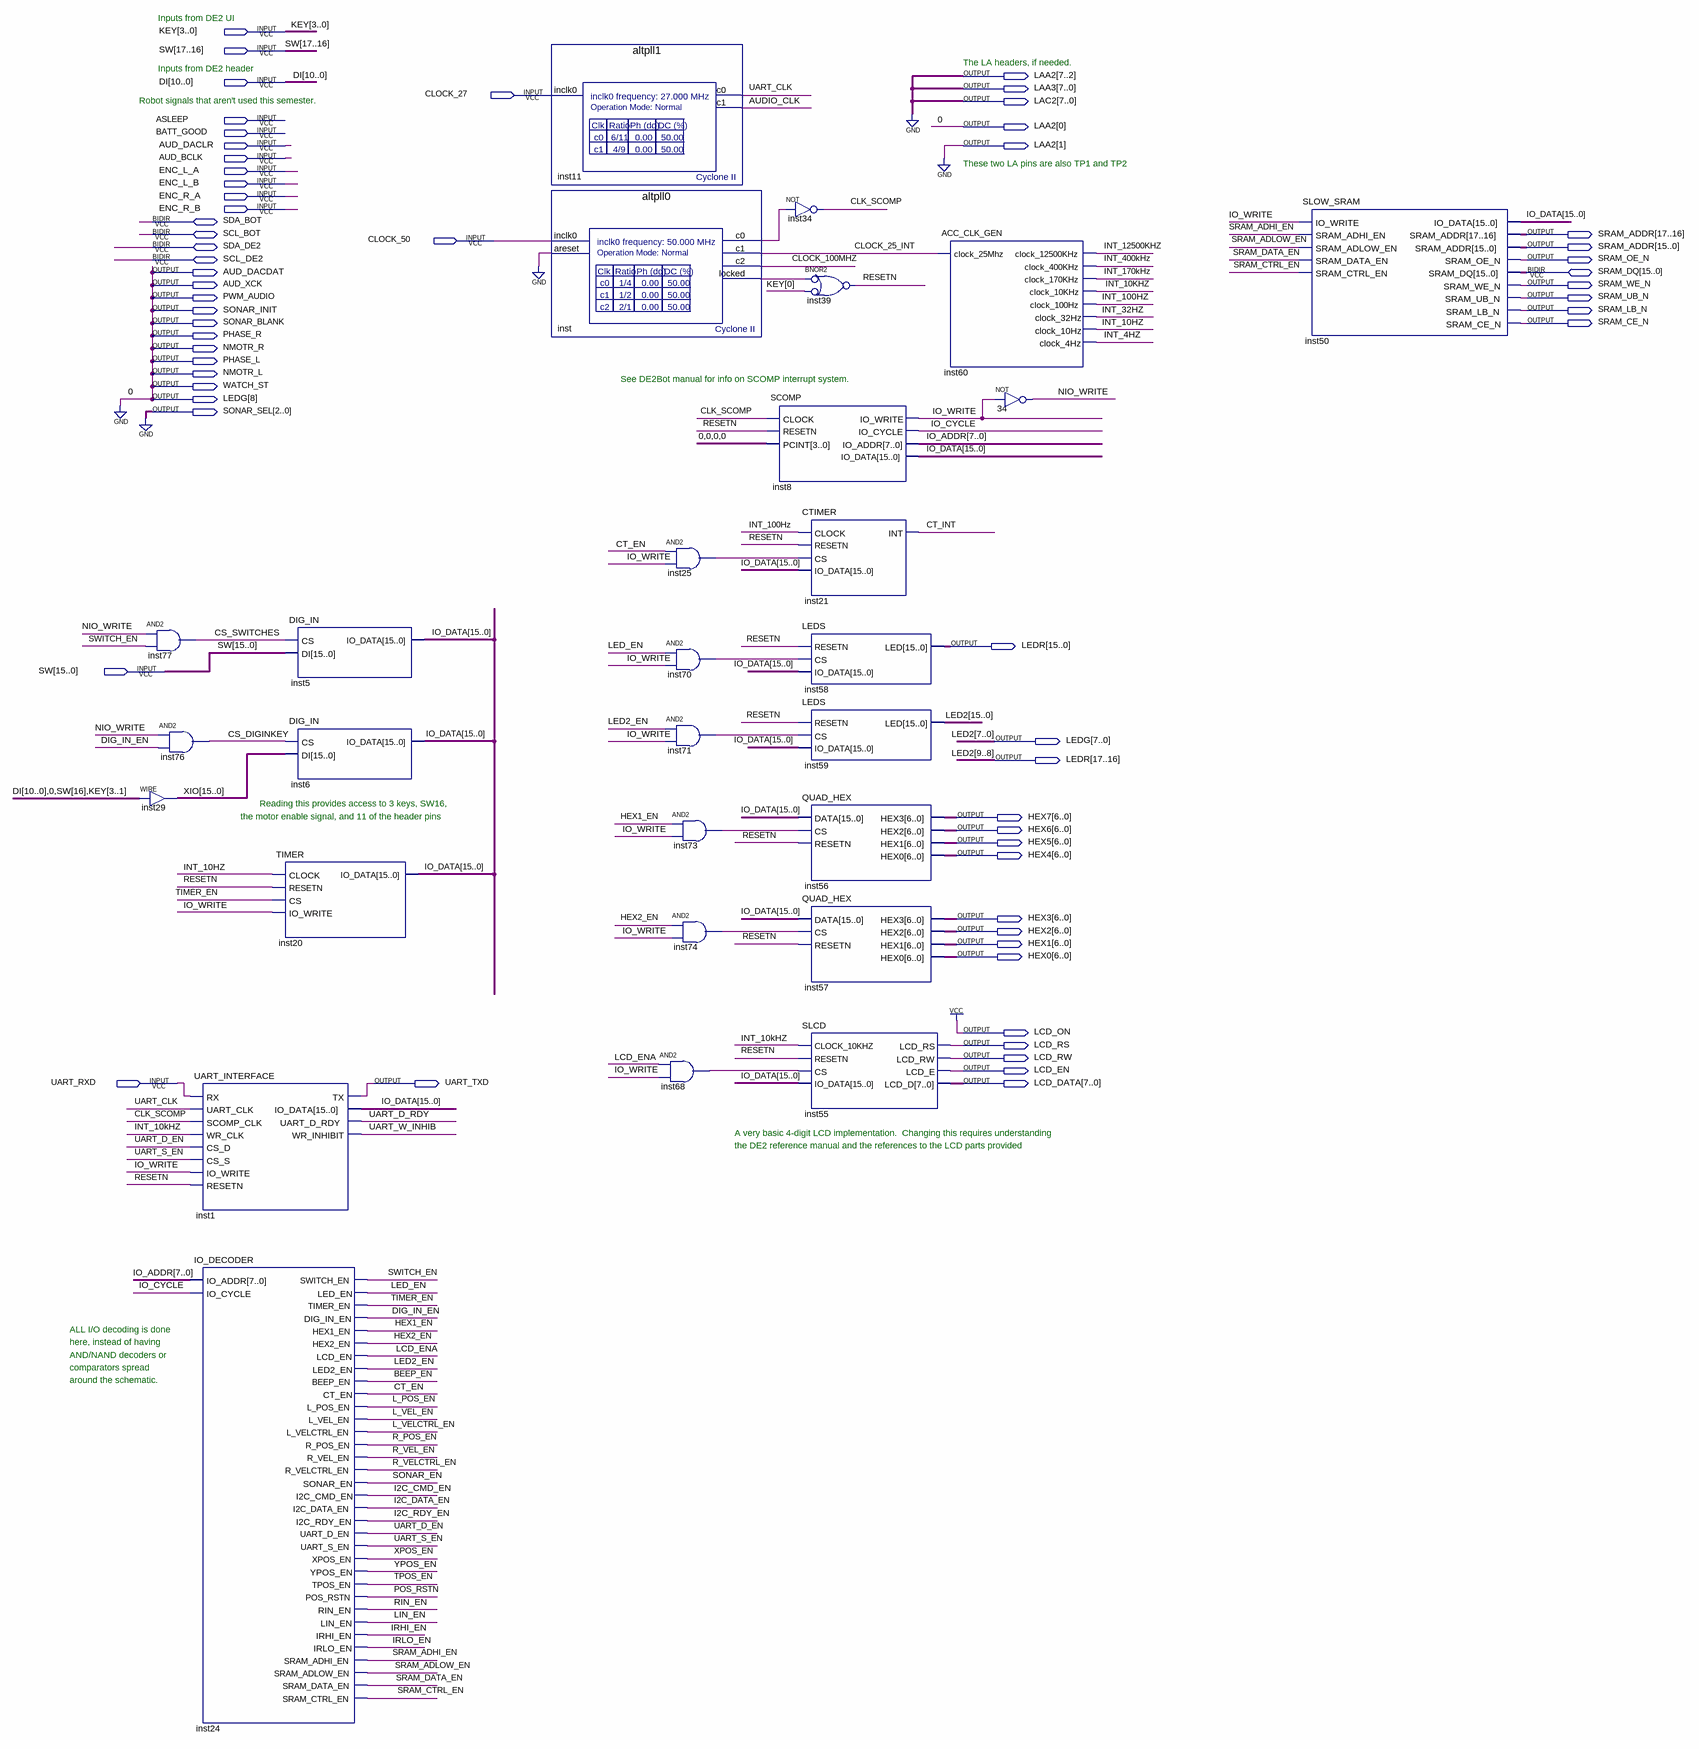
[diagram p0: schematic sheet]
// Quartus schematic DE2bot.bdf as structural Verilog: 28 symbols, 61 pins
module DE2bot (
  input  [3:0] KEY,
  input  [17:0] SW,
  input  [10:0] DI,
  input  CLOCK_27,
  input  ASLEEP,
  input  BATT_GOOD,
  input  AUD_DACLR,
  input  AUD_BCLK,
  input  ENC_L_A,
  input  ENC_L_B,
  input  ENC_R_A,
  input  ENC_R_B,
  input  CLOCK_50,
  input  UART_RXD,
  inout  SDA_BOT,
  inout  SCL_BOT,
  inout  SDA_DE2,
  inout  SCL_DE2,
  inout  [15:0] SRAM_DQ,
  output [7:0] LAA2,
  output [7:0] LAA3,
  output [7:0] LAC2,
  output [17:0] SRAM_ADDR,
  output SRAM_OE_N,
  output AUD_DACDAT,
  output AUD_XCK,
  output SRAM_WE_N,
  output PWM_AUDIO,
  output SRAM_UB_N,
  output SONAR_INIT,
  output SRAM_LB_N,
  output SONAR_BLANK,
  output SRAM_CE_N,
  output PHASE_R,
  output NMOTR_R,
  output PHASE_L,
  output NMOTR_L,
  output WATCH_ST,
  output [8:0] LEDG,
  output [2:0] SONAR_SEL,
  output [17:0] LEDR,
  output [6:0] HEX7,
  output [6:0] HEX6,
  output [6:0] HEX5,
  output [6:0] HEX4,
  output [6:0] HEX3,
  output [6:0] HEX2,
  output [6:0] HEX1,
  output [6:0] HEX0,
  output LCD_ON,
  output LCD_RS,
  output LCD_RW,
  output LCD_EN,
  output UART_TXD,
  output [7:0] LCD_DATA
);

  wire AUDIO_CLK, BEEP_EN, CLK_SCOMP, CLOCK_25_INT, CLOCK_100MHZ, CS_DIGINKEY, CS_SWITCHES, CT_EN, CT_INT,
       DIG_IN_EN, HEX1_EN, HEX2_EN, I2C_CMD_EN, I2C_DATA_EN, I2C_RDY_EN, inst25_out, inst68_out, inst70_out,
       inst71_out, inst73_out, inst74_out, inst_c0, inst_locked, INT_4HZ, INT_10HZ, INT_10kHZ, INT_32HZ,
       INT_100Hz, INT_170kHz, INT_400kHz, INT_12500KHZ, IO_CYCLE, IO_WRITE, IRHI_EN, IRLO_EN, L_POS_EN,
       L_VEL_EN, L_VELCTRL_EN, LCD_ENA, LED2_EN, LED_EN, LIN_EN, NIO_WRITE, POS_RSTN, R_POS_EN, R_VEL_EN,
       R_VELCTRL_EN, RESETN, RIN_EN, SONAR_EN, SRAM_ADHI_EN, SRAM_ADLOW_EN, SRAM_CTRL_EN, SRAM_DATA_EN,
       SWITCH_EN, TIMER_EN, TPOS_EN, UART_CLK, UART_D_EN, UART_D_RDY, UART_S_EN, UART_W_INHIB, XPOS_EN,
       YPOS_EN;
  wire [7:0] IO_ADDR;
  wire [15:0] IO_DATA, XIO;
  wire [15:10] LED2;

  and inst77 (CS_SWITCHES, NIO_WRITE, SWITCH_EN);
  assign XIO = {DI, 1'b0, SW[16], KEY[3:1]};  // WIRE inst29
  and inst76 (CS_DIGINKEY, NIO_WRITE, DIG_IN_EN);
  UART_INTERFACE inst1 (
    .RX(UART_RXD), .UART_CLK(UART_CLK), .SCOMP_CLK(CLK_SCOMP), .WR_CLK(INT_10kHZ), .CS_D(UART_D_EN),
    .CS_S(UART_S_EN), .IO_WRITE(IO_WRITE), .RESETN(RESETN), .TX(UART_TXD), .UART_D_RDY(UART_D_RDY),
    .WR_INHIBIT(UART_W_INHIB), .IO_DATA(IO_DATA));
  IO_DECODER inst24 (
    .IO_ADDR(IO_ADDR), .IO_CYCLE(IO_CYCLE), .SWITCH_EN(SWITCH_EN), .LED_EN(LED_EN), .TIMER_EN(TIMER_EN),
    .DIG_IN_EN(DIG_IN_EN), .HEX1_EN(HEX1_EN), .HEX2_EN(HEX2_EN), .LCD_EN(LCD_ENA), .LED2_EN(LED2_EN),
    .BEEP_EN(BEEP_EN), .CT_EN(CT_EN), .L_POS_EN(L_POS_EN), .L_VEL_EN(L_VEL_EN), .L_VELCTRL_EN(L_VELCTRL_EN),
    .R_POS_EN(R_POS_EN), .R_VEL_EN(R_VEL_EN), .R_VELCTRL_EN(R_VELCTRL_EN), .SONAR_EN(SONAR_EN),
    .I2C_CMD_EN(I2C_CMD_EN), .I2C_DATA_EN(I2C_DATA_EN), .I2C_RDY_EN(I2C_RDY_EN), .UART_D_EN(UART_D_EN),
    .UART_S_EN(UART_S_EN), .XPOS_EN(XPOS_EN), .YPOS_EN(YPOS_EN), .TPOS_EN(TPOS_EN), .POS_RSTN(POS_RSTN),
    .RIN_EN(RIN_EN), .LIN_EN(LIN_EN), .IRHI_EN(IRHI_EN), .IRLO_EN(IRLO_EN), .SRAM_ADHI_EN(SRAM_ADHI_EN),
    .SRAM_ADLOW_EN(SRAM_ADLOW_EN), .SRAM_DATA_EN(SRAM_DATA_EN), .SRAM_CTRL_EN(SRAM_CTRL_EN));
  DIG_IN inst5 (.CS(CS_SWITCHES), .DI(SW[15:0]), .IO_DATA(IO_DATA));
  DIG_IN inst6 (.CS(CS_DIGINKEY), .DI(XIO), .IO_DATA(IO_DATA));
  TIMER inst20 (.CLOCK(INT_10HZ), .RESETN(RESETN), .CS(TIMER_EN), .IO_WRITE(IO_WRITE), .IO_DATA(IO_DATA));
  altpll1 inst11 (.inclk0(CLOCK_27), .c0(UART_CLK), .c1(AUDIO_CLK));
  altpll0 inst (
    .inclk0(CLOCK_50), .areset(1'b0), .c0(inst_c0), .c1(CLOCK_25_INT), .c2(CLOCK_100MHZ), .locked(inst_locked));
  and inst68 (inst68_out, LCD_ENA, IO_WRITE);
  and inst25 (inst25_out, CT_EN, IO_WRITE);
  and inst70 (inst70_out, LED_EN, IO_WRITE);
  and inst71 (inst71_out, LED2_EN, IO_WRITE);
  and inst73 (inst73_out, HEX1_EN, IO_WRITE);
  and inst74 (inst74_out, HEX2_EN, IO_WRITE);
  not inst34 (CLK_SCOMP, inst_c0);
  nor inst39 (RESETN, ~inst_locked, ~KEY[0]);  // BNOR2
  SCOMP inst8 (
    .CLOCK(CLK_SCOMP), .RESETN(RESETN), .PCINT(4'b0000), .IO_WRITE(IO_WRITE), .IO_CYCLE(IO_CYCLE),
    .IO_ADDR(IO_ADDR), .IO_DATA(IO_DATA));
  CTIMER inst21 (.CLOCK(INT_100Hz), .RESETN(RESETN), .CS(inst25_out), .IO_DATA(IO_DATA), .INT(CT_INT));
  LEDS inst58 (.RESETN(RESETN), .CS(inst70_out), .IO_DATA(IO_DATA), .LED(LEDR[15:0]));
  LEDS inst59 (.RESETN(RESETN), .CS(inst71_out), .IO_DATA(IO_DATA), .LED({LED2, LEDR[17:16], LEDG[7:0]}));
  QUAD_HEX inst56 (
    .DATA(IO_DATA), .CS(inst73_out), .RESETN(RESETN), .HEX3(HEX7), .HEX2(HEX6), .HEX1(HEX5), .HEX0(HEX4));
  QUAD_HEX inst57 (
    .DATA(IO_DATA), .CS(inst74_out), .RESETN(RESETN), .HEX3(HEX3), .HEX2(HEX2), .HEX1(HEX1), .HEX0(HEX0));
  SLCD inst55 (
    .CLOCK_10KHZ(INT_10kHZ), .RESETN(RESETN), .CS(inst68_out), .IO_DATA(IO_DATA), .LCD_RS(LCD_RS),
    .LCD_RW(LCD_RW), .LCD_E(LCD_EN), .LCD_D(LCD_DATA));
  ACC_CLK_GEN inst60 (
    .clock_25Mhz(CLOCK_25_INT), .clock_12500KHz(INT_12500KHZ), .clock_400KHz(INT_400kHz),
    .clock_170KHz(INT_170kHz), .clock_10KHz(INT_10kHZ), .clock_100Hz(INT_100Hz), .clock_32Hz(INT_32HZ),
    .clock_10Hz(INT_10HZ), .clock_4Hz(INT_4HZ));
  not u_34 (NIO_WRITE, IO_WRITE);
  SLOW_SRAM inst50 (
    .IO_WRITE(IO_WRITE), .SRAM_ADHI_EN(SRAM_ADHI_EN), .SRAM_ADLOW_EN(SRAM_ADLOW_EN),
    .SRAM_DATA_EN(SRAM_DATA_EN), .SRAM_CTRL_EN(SRAM_CTRL_EN), .SRAM_ADDR(SRAM_ADDR), .SRAM_OE_N(SRAM_OE_N),
    .SRAM_WE_N(SRAM_WE_N), .SRAM_UB_N(SRAM_UB_N), .SRAM_LB_N(SRAM_LB_N), .SRAM_CE_N(SRAM_CE_N),
    .IO_DATA(IO_DATA), .SRAM_DQ(SRAM_DQ));

  assign AUD_DACDAT = 1'b0;
  assign AUD_XCK = 1'b0;
  assign LAA2[1:0] = 2'b00;
  assign LAA3 = {8{1'b0}};
  assign LAC2 = {8{1'b0}};
  assign LCD_ON = 1'b1;
  assign LEDG[8] = 1'b0;
  assign NMOTR_L = 1'b0;
  assign NMOTR_R = 1'b0;
  assign PHASE_L = 1'b0;
  assign PHASE_R = 1'b0;
  assign PWM_AUDIO = 1'b0;
  assign SONAR_BLANK = 1'b0;
  assign SONAR_INIT = 1'b0;
  assign SONAR_SEL = 3'b000;
  assign WATCH_ST = 1'b0;

  // Other names for the same wires on the sheet: LED2[9:0] = {LEDR[17:16], LEDG[7:0]}

  // Notes on the sheet:
  //   Inputs from DE2 UI
  //   The LA headers, if needed.
  //   Inputs from DE2 header
  //   Robot signals that aren't used this semester.
  //   These two LA pins are also TP1 and TP2
  //   See DE2Bot manual for info on SCOMP interrupt system.
  //   Reading this provides access to 3 keys, SW16,
  //   the motor enable signal, and 11 of the header pins
  //   A very basic 4-digit LCD implementation.  Changing this requires understanding
  //   the DE2 reference manual and the references to the LCD parts provided
  //   ALL I/O decoding is done
  //   here, instead of having
  //   AND/NAND decoders or
  //   comparators spread
  //   around the schematic.
endmodule
